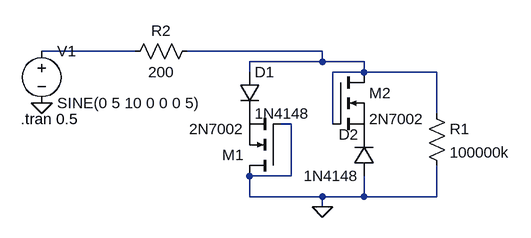
[diagram p0: schematic ZenClipper.asc]
ZenClipper.asc, the LTspice schematic file:
Version 4
SHEET 1 880 680
WIRE 272 128 128 128
WIRE 560 128 352 128
WIRE 560 144 560 128
WIRE 560 144 448 144
WIRE 624 144 560 144
WIRE 448 160 448 144
WIRE 624 160 624 144
WIRE 624 160 576 160
WIRE 736 160 624 160
WIRE 736 224 736 160
WIRE 512 240 496 240
WIRE 576 240 576 160
WIRE 512 320 512 240
WIRE 512 320 448 320
WIRE 448 352 448 320
WIRE 560 352 448 352
WIRE 624 352 624 320
WIRE 624 352 560 352
WIRE 736 352 736 304
WIRE 736 352 624 352
WIRE 560 368 560 352
FLAG 128 208 0
FLAG 560 368 0
SYMBOL voltage 128 112 R0
WINDOW 123 0 0 Left 0
WINDOW 39 0 0 Left 0
SYMATTR InstName V1
SYMATTR Value SINE(0 5 10 0 0 0 5)
SYMBOL diode 432 160 R0
SYMATTR InstName D1
SYMATTR Value 1N4148
SYMBOL nmos 496 320 R180
SYMATTR InstName M1
SYMATTR Value 2N7002
SYMBOL nmos 576 160 R0
SYMATTR InstName M2
SYMATTR Value 2N7002
SYMBOL diode 640 320 R180
WINDOW 0 24 64 Left 2
WINDOW 3 24 0 Left 2
SYMATTR InstName D2
SYMATTR Value 1N4148
SYMBOL res 720 208 R0
SYMATTR InstName R1
SYMATTR Value 100000k
SYMBOL res 368 112 R90
WINDOW 0 0 56 VBottom 2
WINDOW 3 32 56 VTop 2
SYMATTR InstName R2
SYMATTR Value 200
TEXT 96 232 Left 2 !.tran 0.5

The netlist it stands for:
* ZenClipper.asc
V1 N001 0 SINE(0 5 10 0 0 0 5)
D1 N002 P001 1N4148
M1 0 0 P001 P001 2N7002
M2 N002 N002 P002 P002 2N7002
D2 0 P002 1N4148
R1 N002 0 100000k
R2 N002 N001 200
.model D D
.lib standard.dio
.model NMOS NMOS
.model PMOS PMOS
.lib standard.mos
.tran 0.5
.backanno
.end